# Altium schematic sheet AFPGA_FMC2_bank2.SchDoc: AFPGA FMC2
size 420 x 297 mm; CheckedBy: T.Janicki; CompanyName: Creotech Instruments SA; DrawnBy: G.Kasprowicz; Organization: CERN; Address1: European Organization for Nuclear Research; Address2: CH-1211 Geneve 23 - Switzerland; Revision: -; SheetNumber: 6; SheetTotal: 21; EDA_Number: EDA-xxxx; Projet: Simple VME FMC Carrier; ModifiedBy: -; CreateDate: 20/11/2012; CheckedDate: 30/04/2012; Title2: - bank 2 -; DivGrp: BE-CO; Designer: G.Kasprowicz; PageSetup: Record=PageOptions|CenterHorizontal=True|CenterVertical=True|PrintScale=0.95|XCorrection=1.00|YCorrection=1.00|PrintKind=1|BorderSize=5000000|LeftOffset=0|BottomOffset=0|Orientation=2|PaperLength=1000|PaperWidth=1000|Scale=100|PaperSource=15|PrintQuality=600|MediaType=1|DitherType=10|PaperKind=A3|PrintScaleMode=1; ModifiedDate: -
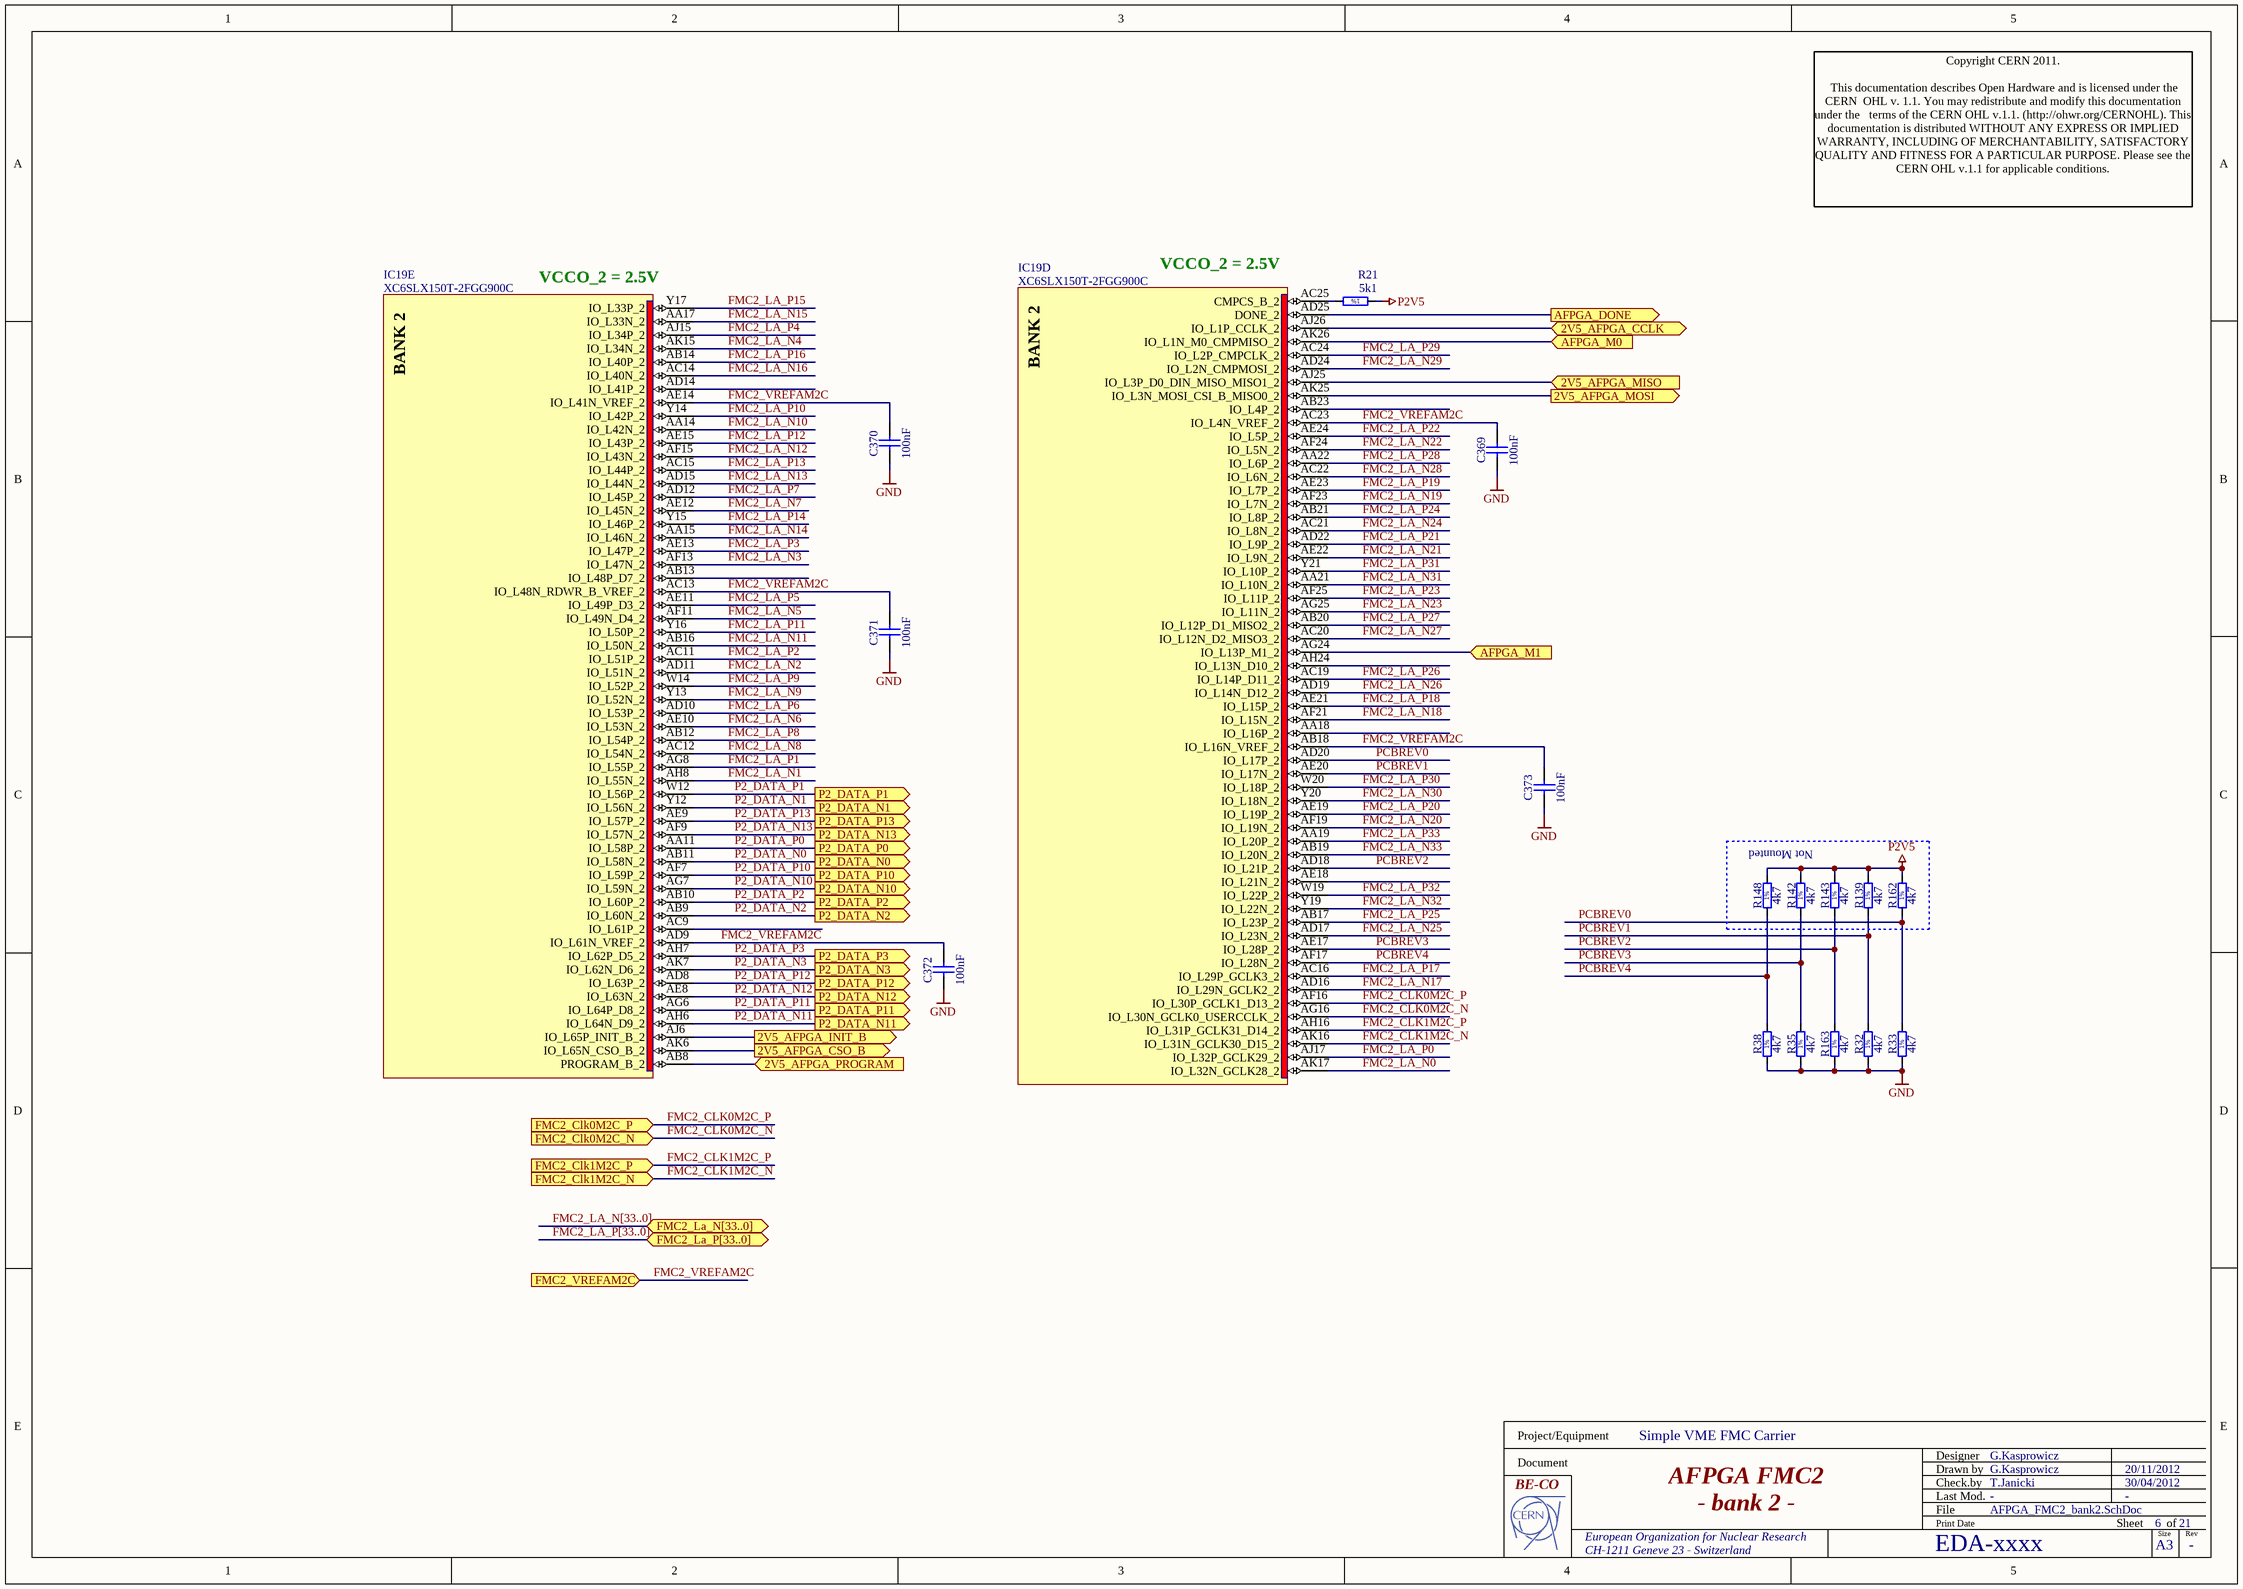
[diagram p0: AFPGA_FMC2_bank2.SchDoc]

## Parts
C369  100nF  [CAPC1005X55N]
C370  100nF  [CAPC1005X55N]
C371  100nF  [CAPC1005X55N]
C372  100nF  [CAPC1005X55N]
C373  100nF  [CAPC1005X55N]
IC19  XC6SLX150T-2FGG900C  [BGA900C100P30X30_3100X3100X260]  (parts D,E of 18)
R21  5k1  [RESC1608X55N]
R32  4k7  [RESC1608X55N]
R33  4k7  [RESC1608X55N]
R35  4k7  [RESC1608X55N]
R38  4k7  [RESC1608X55N]
R139  4k7  [RESC1608X55N]
R142  4k7  [RESC1608X55N]
R143  4k7  [RESC1608X55N]
R148  4k7  [RESC1608X55N]
R162  4k7  [RESC1608X55N]
R163  4k7  [RESC1608X55N]

## Blocks framed on the sheet
Not Mounted: R139 R142 R143 R148 R162

## Ports
2V5_AFPGA_CCLK (bidir), 2V5_AFPGA_CSO_B (out), 2V5_AFPGA_INIT_B (out), 2V5_AFPGA_MISO (in), 2V5_AFPGA_MOSI (out), 2V5_AFPGA_PROGRAM (in), AFPGA_DONE (out), AFPGA_M0 (in), AFPGA_M1 (in), FMC2_Clk0M2C_N (in), FMC2_Clk0M2C_P (in), FMC2_Clk1M2C_N (in), FMC2_Clk1M2C_P (in), FMC2_La_N[33..0] (bidir), FMC2_La_P[33..0] (bidir), FMC2_VREFAM2C (in), P2_DATA_N0 (out), P2_DATA_N1 (out), P2_DATA_N2 (out), P2_DATA_N3 (out), P2_DATA_N10 (out), P2_DATA_N11 (out), P2_DATA_N12 (out), P2_DATA_N13 (out), P2_DATA_P0 (out), P2_DATA_P1 (out), P2_DATA_P2 (out), P2_DATA_P3 (out), P2_DATA_P10 (out), P2_DATA_P11 (out), P2_DATA_P12 (out), P2_DATA_P13 (out)

## Nets
GND: C369.1 C370.1 C371.1 C372.1 C373.1 R32.1 R33.1 R35.1 R38.1 R163.1
P2V5: R21.1 R139.2 R142.2 R143.2 R148.2 R162.2
2V5_AFPGA_CCLK: IC19.AJ26(IO_L1P_CCLK_2) ; port 2V5_AFPGA_CCLK
2V5_AFPGA_CSO_B: IC19.AK6(IO_L65N_CSO_B_2) ; port 2V5_AFPGA_CSO_B
2V5_AFPGA_INIT_B: IC19.AJ6(IO_L65P_INIT_B_2) ; port 2V5_AFPGA_INIT_B
2V5_AFPGA_MISO: IC19.AJ25(IO_L3P_D0_DIN_MISO_MISO1_2) ; port 2V5_AFPGA_MISO
2V5_AFPGA_MOSI: IC19.AK25(IO_L3N_MOSI_CSI_B_MISO0_2) ; port 2V5_AFPGA_MOSI
2V5_AFPGA_PROGRAM: IC19.AB8(PROGRAM_B_2) ; port 2V5_AFPGA_PROGRAM
AFPGA_DONE: IC19.AD25(DONE_2) ; port AFPGA_DONE
AFPGA_M0: IC19.AK26(IO_L1N_M0_CMPMISO_2) ; port AFPGA_M0
AFPGA_M1: IC19.AG24(IO_L13P_M1_2) ; port AFPGA_M1
FMC2_CLK0M2C_N: IC19.AG16(IO_L30N_GCLK0_USERCCLK_2) ; port FMC2_Clk0M2C_N
FMC2_CLK0M2C_P: IC19.AF16(IO_L30P_GCLK1_D13_2) ; port FMC2_Clk0M2C_P
FMC2_CLK1M2C_N: IC19.AK16(IO_L31N_GCLK30_D15_2) ; port FMC2_Clk1M2C_N
FMC2_CLK1M2C_P: IC19.AH16(IO_L31P_GCLK31_D14_2) ; port FMC2_Clk1M2C_P
FMC2_LA_N0: IC19.AK17(IO_L32N_GCLK28_2)
FMC2_LA_N1: IC19.AH8(IO_L55N_2)
FMC2_LA_N2: IC19.AD11(IO_L51N_2)
FMC2_LA_N3: IC19.AF13(IO_L47N_2)
FMC2_LA_N4: IC19.AK15(IO_L34N_2)
FMC2_LA_N5: IC19.AF11(IO_L49N_D4_2)
FMC2_LA_N6: IC19.AE10(IO_L53N_2)
FMC2_LA_N7: IC19.AE12(IO_L45N_2)
FMC2_LA_N8: IC19.AC12(IO_L54N_2)
FMC2_LA_N9: IC19.Y13(IO_L52N_2)
FMC2_LA_N10: IC19.AA14(IO_L42N_2)
FMC2_LA_N11: IC19.AB16(IO_L50N_2)
FMC2_LA_N12: IC19.AF15(IO_L43N_2)
FMC2_LA_N13: IC19.AD15(IO_L44N_2)
FMC2_LA_N14: IC19.AA15(IO_L46N_2)
FMC2_LA_N15: IC19.AA17(IO_L33N_2)
FMC2_LA_N16: IC19.AC14(IO_L40N_2)
FMC2_LA_N17: IC19.AD16(IO_L29N_GCLK2_2)
FMC2_LA_N18: IC19.AF21(IO_L15N_2)
FMC2_LA_N19: IC19.AF23(IO_L7N_2)
FMC2_LA_N20: IC19.AF19(IO_L19N_2)
FMC2_LA_N21: IC19.AE22(IO_L9N_2)
FMC2_LA_N22: IC19.AF24(IO_L5N_2)
FMC2_LA_N23: IC19.AG25(IO_L11N_2)
FMC2_LA_N24: IC19.AC21(IO_L8N_2)
FMC2_LA_N25: IC19.AD17(IO_L23N_2)
FMC2_LA_N26: IC19.AD19(IO_L14N_D12_2)
FMC2_LA_N27: IC19.AC20(IO_L12N_D2_MISO3_2)
FMC2_LA_N28: IC19.AC22(IO_L6N_2)
FMC2_LA_N29: IC19.AD24(IO_L2N_CMPMOSI_2)
FMC2_LA_N30: IC19.Y20(IO_L18N_2)
FMC2_LA_N31: IC19.AA21(IO_L10N_2)
FMC2_LA_N32: IC19.Y19(IO_L22N_2)
FMC2_LA_N33: IC19.AB19(IO_L20N_2)
FMC2_LA_P0: IC19.AJ17(IO_L32P_GCLK29_2)
FMC2_LA_P1: IC19.AG8(IO_L55P_2)
FMC2_LA_P2: IC19.AC11(IO_L51P_2)
FMC2_LA_P3: IC19.AE13(IO_L47P_2)
FMC2_LA_P4: IC19.AJ15(IO_L34P_2)
FMC2_LA_P5: IC19.AE11(IO_L49P_D3_2)
FMC2_LA_P6: IC19.AD10(IO_L53P_2)
FMC2_LA_P7: IC19.AD12(IO_L45P_2)
FMC2_LA_P8: IC19.AB12(IO_L54P_2)
FMC2_LA_P9: IC19.W14(IO_L52P_2)
FMC2_LA_P10: IC19.Y14(IO_L42P_2)
FMC2_LA_P11: IC19.Y16(IO_L50P_2)
FMC2_LA_P12: IC19.AE15(IO_L43P_2)
FMC2_LA_P13: IC19.AC15(IO_L44P_2)
FMC2_LA_P14: IC19.Y15(IO_L46P_2)
FMC2_LA_P15: IC19.Y17(IO_L33P_2)
FMC2_LA_P16: IC19.AB14(IO_L40P_2)
FMC2_LA_P17: IC19.AC16(IO_L29P_GCLK3_2)
FMC2_LA_P18: IC19.AE21(IO_L15P_2)
FMC2_LA_P19: IC19.AE23(IO_L7P_2)
FMC2_LA_P20: IC19.AE19(IO_L19P_2)
FMC2_LA_P21: IC19.AD22(IO_L9P_2)
FMC2_LA_P22: IC19.AE24(IO_L5P_2)
FMC2_LA_P23: IC19.AF25(IO_L11P_2)
FMC2_LA_P24: IC19.AB21(IO_L8P_2)
FMC2_LA_P25: IC19.AB17(IO_L23P_2)
FMC2_LA_P26: IC19.AC19(IO_L14P_D11_2)
FMC2_LA_P27: IC19.AB20(IO_L12P_D1_MISO2_2)
FMC2_LA_P28: IC19.AA22(IO_L6P_2)
FMC2_LA_P29: IC19.AC24(IO_L2P_CMPCLK_2)
FMC2_LA_P30: IC19.W20(IO_L18P_2)
FMC2_LA_P31: IC19.Y21(IO_L10P_2)
FMC2_LA_P32: IC19.W19(IO_L22P_2)
FMC2_LA_P33: IC19.AA19(IO_L20P_2)
FMC2_VREFAM2C: C369.2 C370.2 C371.2 C372.2 C373.2 IC19.AB18(IO_L16N_VREF_2) IC19.AC13(IO_L48N_RDWR_B_VREF_2) IC19.AC23(IO_L4N_VREF_2) IC19.AD9(IO_L61N_VREF_2) IC19.AE14(IO_L41N_VREF_2) ; port FMC2_VREFAM2C
P2_DATA_N0: IC19.AB11(IO_L58N_2) ; port P2_DATA_N0
P2_DATA_N1: IC19.Y12(IO_L56N_2) ; port P2_DATA_N1
P2_DATA_N2: IC19.AB9(IO_L60N_2) ; port P2_DATA_N2
P2_DATA_N3: IC19.AK7(IO_L62N_D6_2) ; port P2_DATA_N3
P2_DATA_N10: IC19.AG7(IO_L59N_2) ; port P2_DATA_N10
P2_DATA_N11: IC19.AH6(IO_L64N_D9_2) ; port P2_DATA_N11
P2_DATA_N12: IC19.AE8(IO_L63N_2) ; port P2_DATA_N12
P2_DATA_N13: IC19.AF9(IO_L57N_2) ; port P2_DATA_N13
P2_DATA_P0: IC19.AA11(IO_L58P_2) ; port P2_DATA_P0
P2_DATA_P1: IC19.W12(IO_L56P_2) ; port P2_DATA_P1
P2_DATA_P2: IC19.AB10(IO_L60P_2) ; port P2_DATA_P2
P2_DATA_P3: IC19.AH7(IO_L62P_D5_2) ; port P2_DATA_P3
P2_DATA_P10: IC19.AF7(IO_L59P_2) ; port P2_DATA_P10
P2_DATA_P11: IC19.AG6(IO_L64P_D8_2) ; port P2_DATA_P11
P2_DATA_P12: IC19.AD8(IO_L63P_2) ; port P2_DATA_P12
P2_DATA_P13: IC19.AE9(IO_L57P_2) ; port P2_DATA_P13
PCBREV0: IC19.AD20(IO_L17P_2) R33.2 R162.1
PCBREV1: IC19.AE20(IO_L17N_2) R32.2 R139.1
PCBREV2: IC19.AD18(IO_L21P_2) R143.1 R163.2
PCBREV3: IC19.AE17(IO_L28P_2) R35.2 R142.1
PCBREV4: IC19.AF17(IO_L28N_2) R38.2 R148.1
NetIC19_AC25: IC19.AC25(CMPCS_B_2) R21.2

Not connected (* = marked no-connect by the designer): IC19 AA18(IO_L16P_2) AB13(IO_L48P_D7_2) AB23(IO_L4P_2) AC9(IO_L61P_2) AD14(IO_L41P_2) AE18(IO_L21N_2) AH24(IO_L13N_D10_2)

## Buses and harness runs
bus FMC2_LA_N[33..0] = port FMC2_La_N[33..0]
bus FMC2_LA_P[33..0] = port FMC2_La_P[33..0]

## Notes on the sheet
- Copyright CERN 2011.
  This documentation describes Open Hardware and is licensed under the CERN  OHL v. 1.1. You may redistribute and modify this documentation under the   terms of the CERN OHL v.1.1. (http://ohwr.org/CERNOHL). This  documentation is distributed WITHOUT ANY EXPRESS OR IMPLIED  WARRANTY, INCLUDING OF MERCHANTABILITY, SATISFACTORY  QUALITY AND FITNESS FOR A PARTICULAR PURPOSE. Please see the  CERN OHL v.1.1 for applicable conditions.
- (near IC19) VCCO_2 = 2.5V
- Project/Equipment
- Document
- Designer
- Drawn by
- Check.by
- File
- Last Mod.
- Print Date
- Sheet
- Size
- A3
- of
- Rev
- (in symbol R0603_4K7_1%_0.1W_100PPM) 1%
- (in symbol R0603_5K1_1%_0.1W_100PPM) 1%
- (in symbol XC6SLX150T-2FGG900C, part D) BANK 2
- (in symbol XC6SLX150T-2FGG900C, part E) BANK 2

## Library data of the parts
C369-C373 = CC0402_100NF_16V_10%_X7R: Non-polarised capacitor; Part Description: SMD Multilayer Chip Ceramic Capacitor; Manufacturer: GENERIC; Manufacturer1 Part Number: 223878715649; Voltage: 16V; TC: X7R; Tolerance: ±10%; Table: Capacitors SMD; Part Number: CC0402_100NF_16V_10%_X7R; Component Kind: Standard; Component Type: Standard; Pin Count: 2; Value: 100nF; Status: Not Recommended; Manufacturer Part Number: CC0402_100NF_16V_10%_X7R; Case: 0402; Mounted: Yes; Socket: No; SMD: Yes; Manufacturer1 Example: PHYCOMP; Manufacturer1 ComponentHeight: 0.55mm; HelpURL: \\cern.ch\dfs\Applications\Altium\Datasheets\CC0402_X7R_PHYCOMP.pdf; Author: CERN DEM JLC; CreateDate: 03/12/2007; LatestRevisionDate: 03/12/2007
IC19 = XC6SLX150T-2FGG900C: SPARTAN-6, FPGA, 900-Ball BGA, Commercial Grade, Pb-Free; Part Description: SPARTAN-6, FPGA, 540 User I/Os, 8 GTPs, 900-Ball BGA, Commercial Grade, Pb-Free; Manufacturer: XILINX; Table: Logic; Part Number: XC6SLX150T-2FGG900C; Component Kind: Standard; Component Type: Standard; Device: XC6SLX150T-2FGG900C; PackageDescription: BGA,1.00mm pitch, square; 900 pin, 30 columns X 30 rows, 31.00mm X 31.00mm X 2.60mm H, IPC Medium Density; Manufacturer Part Number: XC6SLX150T-2FGG900C; Pin Count: 900; Case: BGA900; Mounted: Yes; Socket: No; SMD: Yes; ComponentHeight: 2.6mm; HelpURL: \\cern.ch\dfs\Applications\Altium\Datasheets\XC6SLX150T-2FGG900C.pdf; ComponentLink1URL: \\cern.ch\dfs\Applications\Altium\Datasheets\XC6SLX150T-2FGG900C_Package-Pinouts.pdf; ComponentLink1Description: Package/Pinouts; Author: CERN DEM JLC; CreateDate: 2009-11-17; LatestRevisionDate: 2009-11-17
R21 = R0603_5K1_1%_0.1W_100PPM: Resistor - 1%; Part Description: General Purpose Thick Film Chip Resistor; Manufacturer: GENERIC; Manufacturer1 Part Number: NRC06F5101TRF; Power: 0.1W; TC: ±100ppm/°C; Table: Resistors SMD; Part Number: R0603_5K1_1%_0.1W_100PPM; Component Kind: Standard; Component Type: Standard; Pin Count: 2; Value: 5k1; Status: Preferred; Tolerance: ±1%; Manufacturer Part Number: R0603_5K1_1%_0.1W_100PPM; Case: 0603; Mounted: Yes; Socket: No; SMD: Yes; Manufacturer1 Example: NIC COMPONENT; Manufacturer1 ComponentHeight: 0.55mm; HelpURL: \\cern.ch\dfs\Applications\Altium\Datasheets\R0603_NIC_NRC.pdf; Author: CERN DEM JLC; CreateDate: 03/12/2007; LatestRevisionDate: 13/03/2008
R32 R33 R35 R38 R163 = R0603_4K7_1%_0.1W_100PPM: Resistor - 1%; Part Description: General Purpose Thick Film Chip Resistor; Manufacturer: GENERIC; Manufacturer1 Part Number: NRC06F4701TRF; Power: 0.1W; TC: ±100ppm/°C; Table: Resistors SMD; Part Number: R0603_4K7_1%_0.1W_100PPM; Component Kind: Standard; Component Type: Standard; Pin Count: 2; Value: 4k7; Status: Preferred; Tolerance: ±1%; Manufacturer Part Number: R0603_4K7_1%_0.1W_100PPM; Case: 0603; Mounted: Yes; Socket: No; SMD: Yes; Manufacturer1 Example: NIC COMPONENT; Manufacturer1 ComponentHeight: 0.55mm; HelpURL: \\cern.ch\dfs\Applications\Altium\Datasheets\R0603_NIC_NRC.pdf; Author: CERN DEM JLC; CreateDate: 03/12/2007; LatestRevisionDate: 13/03/2008
R139 R142 R143 R148 R162 = R0603_4K7_1%_0.1W_100PPM: Resistor - 1%; Part Description: General Purpose Thick Film Chip Resistor; Manufacturer: GENERIC; Manufacturer1 Part Number: NRC06F4701TRF; Power: 0.1W; TC: ±100ppm/°C; Mounted: No; Table: Resistors SMD; Part Number: R0603_4K7_1%_0.1W_100PPM; Component Kind: Standard; Component Type: Standard; Pin Count: 2; Value: 4k7; Status: Preferred; Tolerance: ±1%; Manufacturer Part Number: R0603_4K7_1%_0.1W_100PPM; Case: 0603; Socket: No; SMD: Yes; Manufacturer1 Example: NIC COMPONENT; Manufacturer1 ComponentHeight: 0.55mm; HelpURL: \\cern.ch\dfs\Applications\Altium\Datasheets\R0603_NIC_NRC.pdf; Author: CERN DEM JLC; CreateDate: 03/12/2007; LatestRevisionDate: 13/03/2008